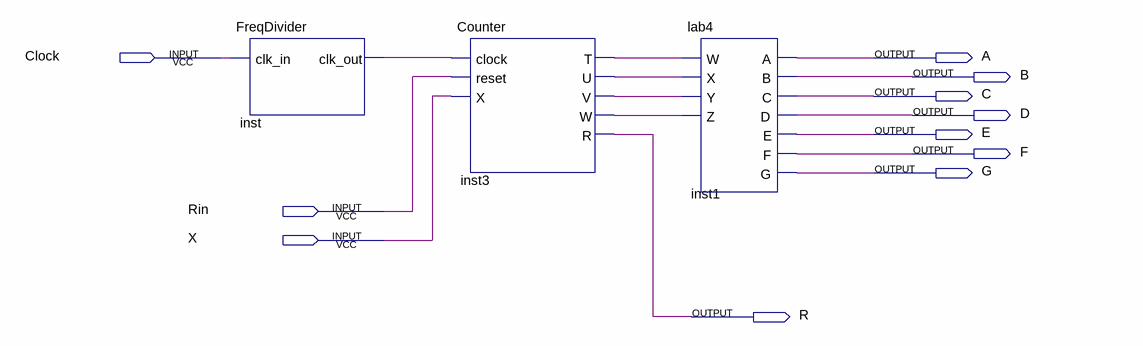
[diagram p0: schematic sheet]
// Quartus schematic CounterDisplay.bdf as structural Verilog: 3 symbols, 11 pins
module CounterDisplay (
  input  Clock,
  input  Rin,
  input  X,
  output A,
  output B,
  output C,
  output D,
  output E,
  output F,
  output G,
  output R
);

  wire inst3_t, inst3_u, inst3_v, inst3_w, inst_clk_out;

  FreqDivider inst (.clk_in(Clock), .clk_out(inst_clk_out));
  Counter inst3 (.clock(inst_clk_out), .reset(Rin), .X(X), .T(inst3_t), .U(inst3_u), .V(inst3_v), .W(inst3_w), .R(R));
  lab4 inst1 (.W(inst3_t), .X(inst3_u), .Y(inst3_v), .Z(inst3_w), .A(A), .B(B), .C(C), .D(D), .E(E), .F(F), .G(G));
endmodule
